# EAGLE design Honig Sensor Board_2 (EAGLE 9.6.1)
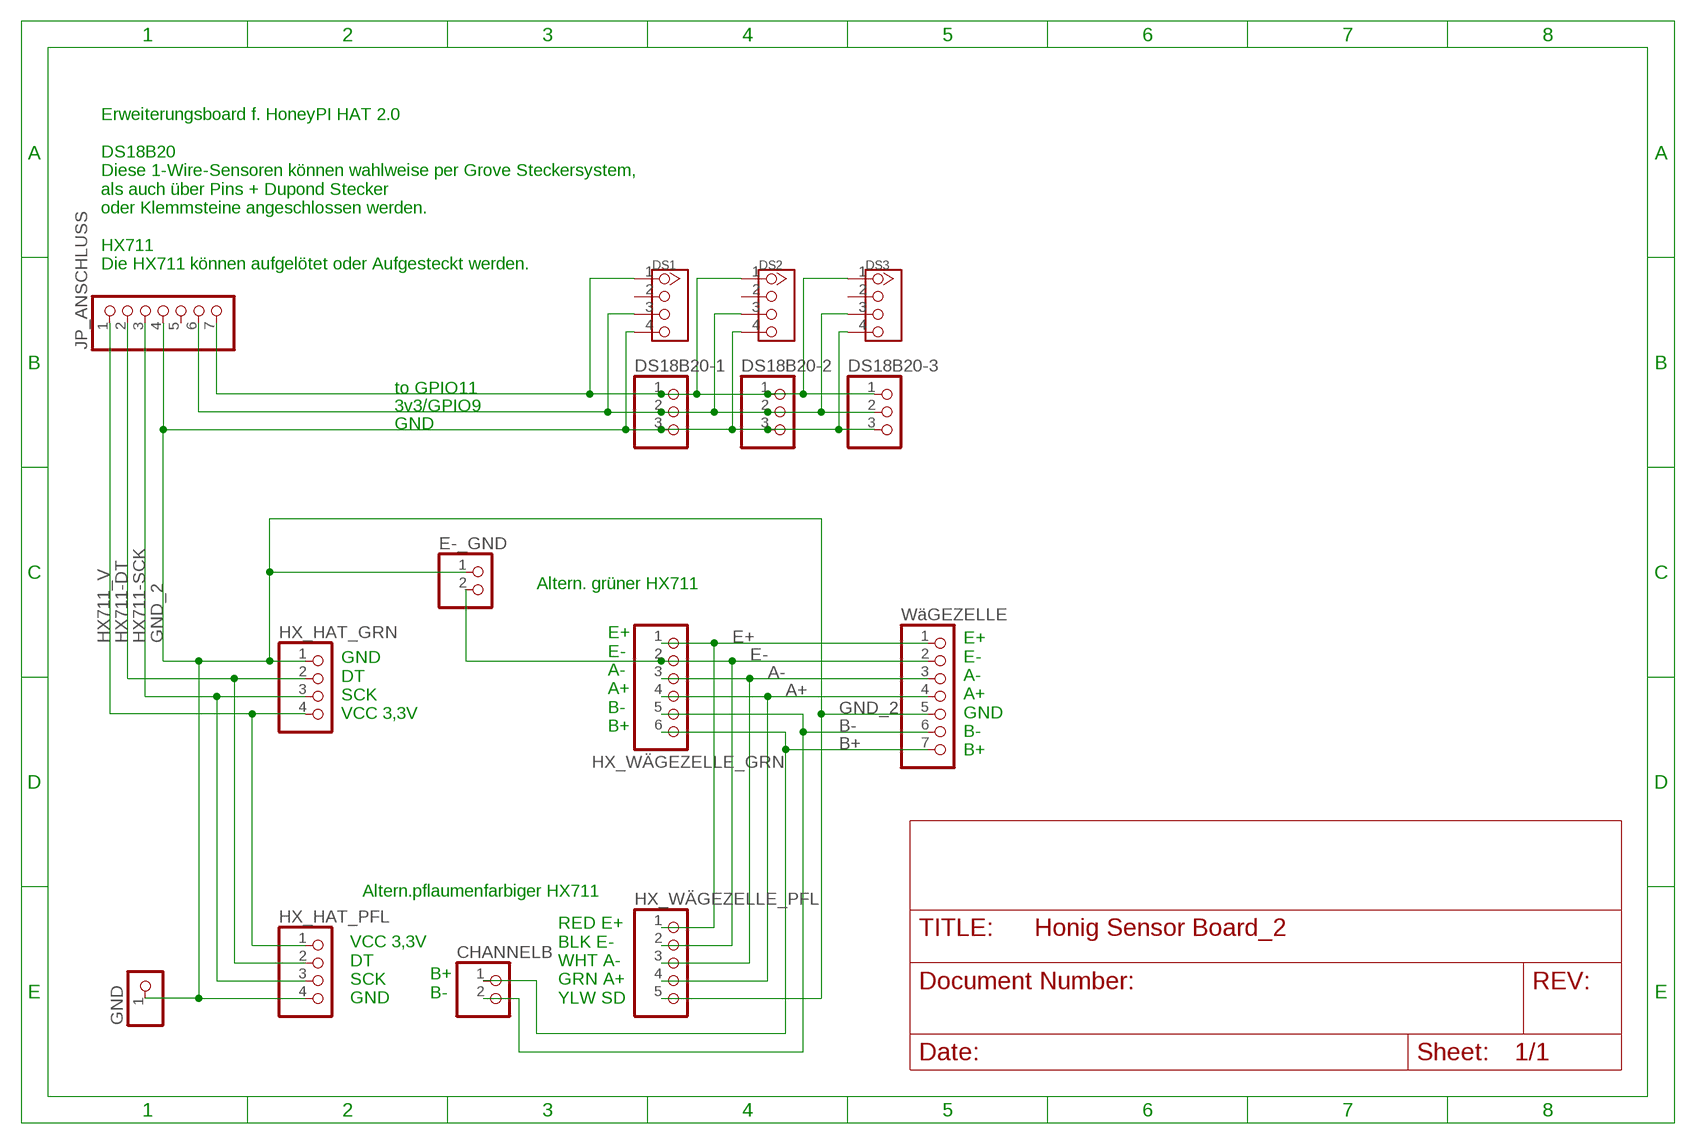
[diagram p0: schematic, sheet 1]

## Parts
CHANNELB  PINHD-1X2  [1X02]
DS1  TWIG-4P-2.0-2.0  [4P-2.0]
DS2  TWIG-4P-2.0-2.0  [4P-2.0]
DS3  TWIG-4P-2.0-2.0  [4P-2.0]
DS18B20-1  PINHD-1X3  [1X03]
DS18B20-2  PINHD-1X3  [1X03]
DS18B20-3  PINHD-1X3  [1X03]
E-_GND  PINHD-1X2  [1X02]
GND  PINHD-1X1  [1X01]
HX_HAT_GRN  PINHD-1X4  [1X04]
HX_HAT_PFL  PINHD-1X4  [1X04]
HX_WÄGEZELLE_GRN  PINHD-1X6  [1X06]
HX_WÄGEZELLE_PFL  PINHD-1X5  [1X05]
JP_ANSCHLUSS  PINHD-1X7  [1X07]
WäGEZELLE  PINHD-1X7  [1X07]

## Nets
3V3 [Supply3v3]: DS1.3 DS2.3 DS3.3 DS18B20-1.2 DS18B20-2.2 DS18B20-3.2 JP_ANSCHLUSS.6
A+: HX_WÄGEZELLE_GRN.4 HX_WÄGEZELLE_PFL.4 WäGEZELLE.4
A-: HX_WÄGEZELLE_GRN.3 HX_WÄGEZELLE_PFL.3 WäGEZELLE.3
B+: CHANNELB.1 HX_WÄGEZELLE_GRN.6 WäGEZELLE.7
B-: CHANNELB.2 HX_WÄGEZELLE_GRN.5 WäGEZELLE.6
DS18B20_DATA_GPIO11_PIN23: DS1.1 DS2.1 DS3.1 DS18B20-1.1 DS18B20-2.1 DS18B20-3.1 JP_ANSCHLUSS.7
E+: HX_WÄGEZELLE_GRN.1 HX_WÄGEZELLE_PFL.1 WäGEZELLE.1
E-: E-_GND.2 HX_WÄGEZELLE_GRN.2 HX_WÄGEZELLE_PFL.2 WäGEZELLE.2
GND_2 [Supply3v3]: DS1.4 DS2.4 DS3.4 DS18B20-1.3 DS18B20-2.3 DS18B20-3.3 E-_GND.1 GND.1 HX_HAT_GRN.1 HX_HAT_PFL.4 HX_WÄGEZELLE_PFL.5 JP_ANSCHLUSS.4 WäGEZELLE.5
HX711-DT: HX_HAT_GRN.2 HX_HAT_PFL.2 JP_ANSCHLUSS.2
HX711-SCK: HX_HAT_GRN.3 HX_HAT_PFL.3 JP_ANSCHLUSS.3
HX711_V [Supply5v]: HX_HAT_GRN.4 HX_HAT_PFL.1 JP_ANSCHLUSS.1
Unconnected: DS1.2 DS2.2 DS3.2 JP_ANSCHLUSS.5

## Notes on the sheet
- Erweiterungsboard f. HoneyPI HAT 2.0
  
  DS18B20
  Diese 1-Wire-Sensoren können wahlweise per Grove Steckersystem,
  als auch über Pins + Dupond Stecker
  oder Klemmsteine angeschlossen werden.
  
  HX711
  Die HX711 können aufgelötet oder Aufgesteckt werden.
- to GPIO11
- 3v3/GPIO9
- GND
- Altern. grüner HX711
- GND
  DT
  SCK
  VCC 3,3V
- E+
  E-
  A-
  A+
  B-
  B+
- E+
  E-
  A-
  A+
  GND
  B-
  B+
- Altern.pflaumenfarbiger HX711
- B+
  B-
- VCC 3,3V
  DT
  SCK
  GND
- RED E+
  BLK E-
  WHT A-
  GRN A+
  YLW SD

## Library data of the parts
CHANNELB E-_GND = pinhead:PINHD-1X2: PIN HEADER
DS1-DS3 = Connector:TWIG-4P-2.0
DS18B20-1-DS18B20-3 = pinhead:PINHD-1X3: PIN HEADER
GND = pinhead:PINHD-1X1: PIN HEADER
HX_HAT_GRN HX_HAT_PFL = pinhead:PINHD-1X4: PIN HEADER
HX_WÄGEZELLE_GRN = pinhead:PINHD-1X6: PIN HEADER
HX_WÄGEZELLE_PFL = pinhead:PINHD-1X5: PIN HEADER
JP_ANSCHLUSS WäGEZELLE = pinhead:PINHD-1X7: PIN HEADER

## Net classes
0 Signal: width 0.152 mm, clearance 0.305 mm
1 Supply3v3: width 0.203 mm, clearance 0.305 mm
2 Supply5v: width 0.406 mm, clearance 0.305 mm

## Board
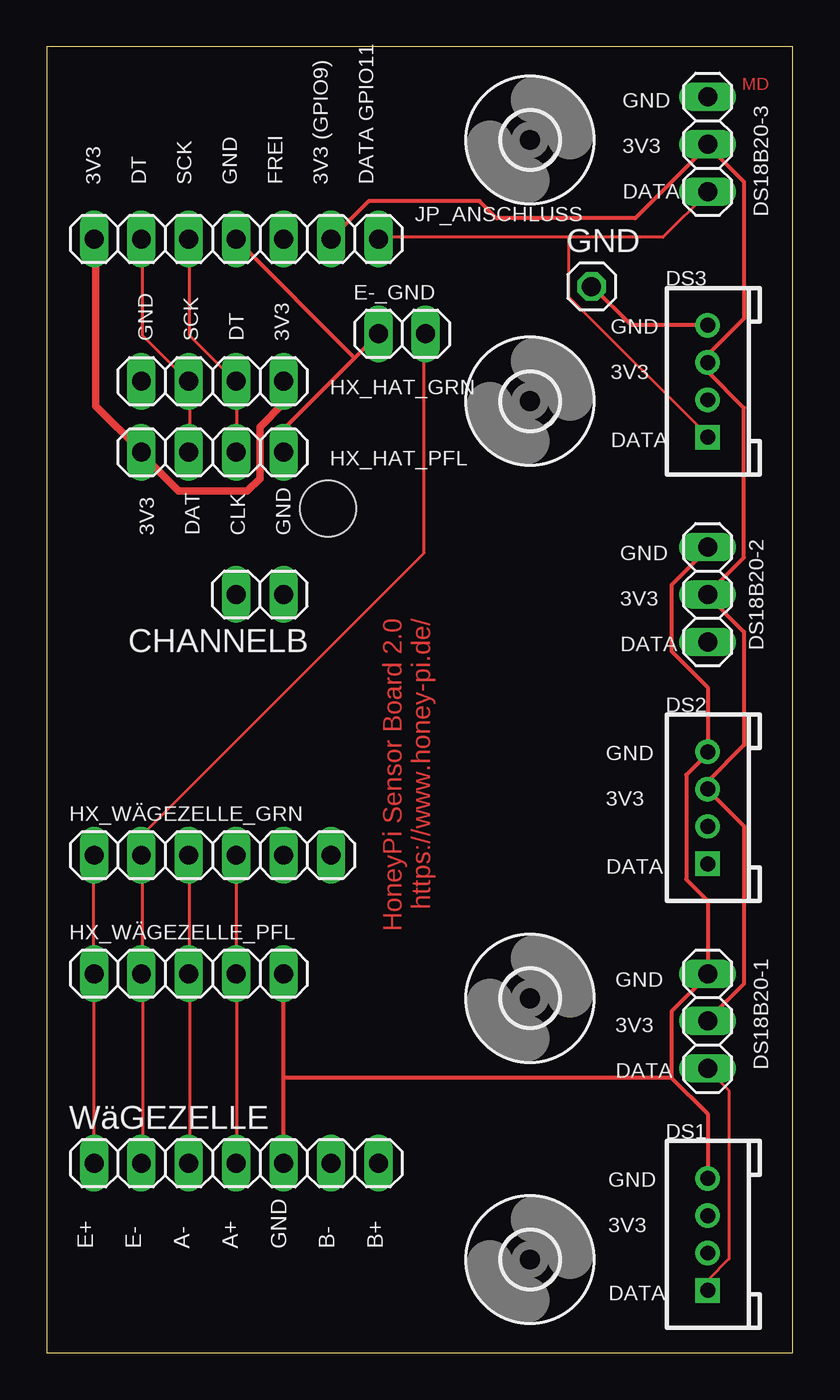
[diagram p1: board, top side]
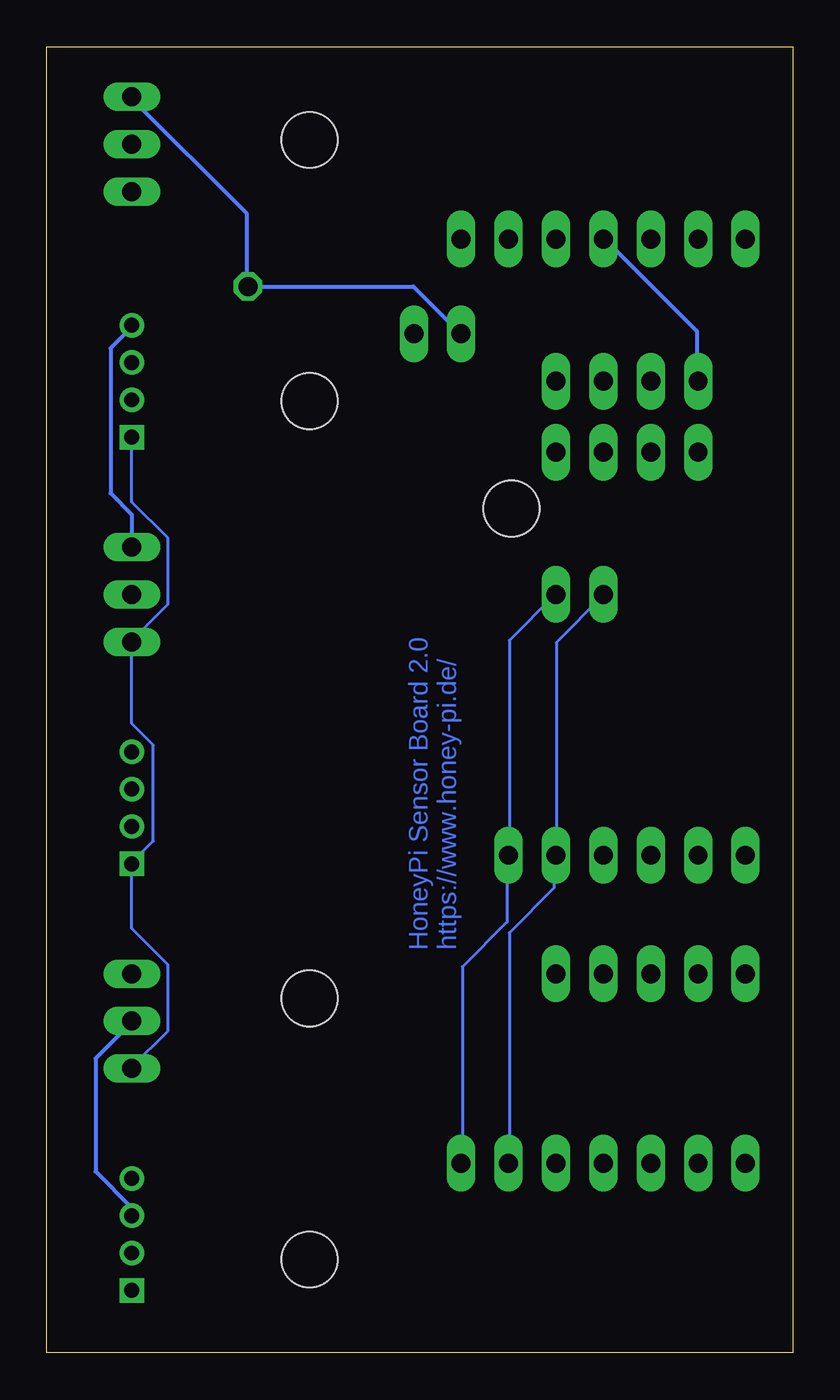
[diagram p2: board, bottom side, seen from below]

Size 40 x 70 mm. Coordinates in mm from the lower left corner, seen from the top.
Outline: 0,0 40,0 40,70 0,70 0,0
Copper layers (1*16): Top 0.035mm / dielectric 1.5mm / Bottom 0.035mm
Design rules "default *": minimum track width 6mil, minimum drill 0.35mm, track to track 6mil, track to pad 6mil, pad to pad 6mil, via to via 6mil, smd to smd 6mil, copper to edge 40mil, drill to drill 1mm, minimum pad ring 10mil, minimum via ring 8mil, stop-mask expansion 4mil, vias tented up to drill 0mil, thermal gap 10mil
Holes 3 mm at 15.08,45.24

### Footprints (pad centres in the part's own frame; a part is rotated, then mirrored left to right if it is on the bottom)
1X02 = drill 1.016 long: 1 -1.27,0; 2 1.27,0
4P-2.0 = drill 0.8 pad 1.27 square: 1 -3,0 | drill 0.8 pad 1.27: 2 -1,0; 3 1,0; 4 3,0
1X03 = drill 1.016 long: 1 -2.54,0; 2 0,0; 3 2.54,0
1X01 = drill 1.016 octagon: 1 0,0
1X04 = drill 1.016 long: 1 -3.81,0; 2 -1.27,0; 3 1.27,0; 4 3.81,0
1X06 = drill 1.016 long: 1 -6.35,0; 2 -3.81,0; 3 -1.27,0; 4 1.27,0; 5 3.81,0; 6 6.35,0
1X05 = drill 1.016 long: 1 -5.08,0; 2 -2.54,0; 3 0,0; 4 2.54,0; 5 5.08,0
1X07 = drill 1.016 long: 1 -7.62,0; 2 -5.08,0; 3 -2.54,0; 4 0,0; 5 2.54,0; 6 5.08,0; 7 7.62,0
3,0 = hole 3: 0,0

### Placement (x,y rotation side)
CHANNELB  11.43,40.64 180 top
DS1  35.43,6.35 90 top
DS2  35.43,29.21 90 top
DS3  35.43,52.07 90 top
DS18B20-1  35.43,17.78 90 top
DS18B20-2  35.43,40.64 90 top
DS18B20-3  35.43,64.77 90 top
E-_GND  19.05,54.61 0 top
GND  29.21,57.15 0 top
HX_HAT_GRN  8.89,52.07 0 top
HX_HAT_PFL  8.89,48.26 0 top
HX_WÄGEZELLE_GRN  8.89,26.67 0 top
HX_WÄGEZELLE_PFL  7.62,20.32 0 top
JP_ANSCHLUSS  10.16,59.69 0 top
U$1  [3,0]  25.91,5 0 top
U$2  [3,0]  25.91,65 0 top
U$3  [3,0]  25.91,19 0 top
U$4  [3,0]  25.91,51 0 top
WäGEZELLE  10.16,10.16 0 top

### Tracks (layer width: path | path; a pad name or v marks a point on that pad's centre or on a via)
3V3
  Top 0.203: 35.43,64.69 37.38,62.75 37.38,55.44 35.43,53.49 DS3.3 35.43,52.58 37.38,50.63 37.38,42.63 35.43,40.69 DS18B20-2.2 35.43,40.58 37.38,38.63 37.38,32.58 35.43,30.63 DS2.3 35.43,30.18 37.38,28.23 37.38,19.77 35.43,17.83 DS18B20-1.2 | 35.43,64.69 31.55,60.81 24.12,60.81 23.2,61.72 17.26,61.72 15.32,59.78 JP_ANSCHLUSS.6 | 35.43,64.69 DS18B20-3.2
  Bottom 0.203: DS1.3 35.43,7.77 37.38,9.72 37.38,15.77 35.43,17.72 DS18B20-1.2
A+
  Top 0.152: WäGEZELLE.4 10.17,10.17 10.17,20.23 HX_WÄGEZELLE_PFL.4 10.17,20.34 10.17,26.63 HX_WÄGEZELLE_GRN.4
A-
  Top 0.152: WäGEZELLE.3 7.66,10.17 7.66,20.23 HX_WÄGEZELLE_PFL.3 7.66,20.34 7.66,26.63 HX_WÄGEZELLE_GRN.3
B+
  Bottom 0.152: CHANNELB.1 12.8,40.58 15.2,38.18 15.2,26.75 HX_WÄGEZELLE_GRN.6 15.32,26.63 15.32,23.09 17.72,20.69 17.72,10.17 WäGEZELLE.7
B-
  Bottom 0.152: CHANNELB.2 10.17,40.58 12.69,38.06 12.69,26.75 HX_WÄGEZELLE_GRN.5 12.8,26.63 12.8,24.92 15.2,22.52 15.2,10.17 WäGEZELLE.6
DS18B20_DATA_GPIO11_PIN23
  Top 0.152: 28,59.78 33.03,59.78 35.43,62.18 DS18B20-3.1 | 28,59.78 17.83,59.78 JP_ANSCHLUSS.7 | DS1.1 35.43,3.89 36.58,5.03 36.58,14.06 35.43,15.2 DS18B20-1.1 | 28,59.78 28,56.58 35.43,49.15 DS3.1
  Bottom 0.152: DS3.1 35.43,45.61 33.49,43.66 33.49,40.12 35.43,38.18 DS18B20-2.1 35.43,33.72 34.29,32.58 34.29,27.43 35.43,26.29 DS2.1 35.43,22.75 33.49,20.8 33.49,17.26 35.43,15.32 DS18B20-1.1
E+
  Top 0.152: WäGEZELLE.1 2.52,10.17 2.52,20.23 HX_WÄGEZELLE_PFL.1 2.52,20.34 2.52,26.63 HX_WÄGEZELLE_GRN.1
E-
  Top 0.152: WäGEZELLE.2 5.14,10.17 5.14,20.23 HX_WÄGEZELLE_PFL.2 5.14,20.34 5.14,26.63 HX_WÄGEZELLE_GRN.2 5.14,26.75 5.14,27.77 20.23,42.86 20.23,54.52 E-_GND.2
GND_2
  Top 0.203: 12.69,14.74 12.69,20.23 HX_WÄGEZELLE_PFL.5 | 12.69,14.74 12.69,10.17 WäGEZELLE.5 | DS1.4 35.43,12.8 33.49,14.74 | 33.49,14.74 33.49,18.29 35.43,20.23 DS18B20-1.3 35.43,24.23 34.29,25.38 34.29,30.98 35.43,32.12 DS2.4 35.43,35.66 33.49,37.6 33.49,41.15 35.43,43.09 DS18B20-2.3 | 33.49,14.74 12.69,14.74 | 16.52,53.32 17.72,54.52 E-_GND.1 | 16.52,53.32 12.8,49.61 12.8,48.35 HX_HAT_PFL.4 | 16.52,53.32 10.17,59.66 JP_ANSCHLUSS.4 | DS3.4 35.43,55.09 31.32,55.09 29.26,57.15 GND.1
  Bottom 0.203: HX_HAT_GRN.1 5.14,52.12 5.14,54.75 10.06,59.66 JP_ANSCHLUSS.4 | DS18B20-3.3 35.43,67.21 29.26,61.04 29.26,57.15 GND.1 20.34,57.15 17.83,54.63 E-_GND.1 | DS18B20-2.3 35.43,44.92 36.58,46.06 36.58,53.84 35.43,54.98 DS3.4
HX711-DT
  Top 0.152: HX_HAT_PFL.2 7.66,48.35 7.66,52.01 HX_HAT_GRN.2 7.54,52.12 5.14,54.52 5.14,59.66 JP_ANSCHLUSS.2
HX711-SCK
  Top 0.152: HX_HAT_PFL.3 10.17,48.35 10.17,52.01 HX_HAT_GRN.3 10.06,52.12 7.66,54.52 7.66,59.66 JP_ANSCHLUSS.3
HX711_V
  Top 0.406: JP_ANSCHLUSS.1 2.63,59.66 2.63,50.75 5.03,48.35 HX_HAT_PFL.1 5.14,48.12 7.09,46.18 10.74,46.18 11.43,46.86 11.43,49.61 12.69,50.86 12.69,52.01 HX_HAT_GRN.4

### Text on the board
Top: MD | HoneyPi Sensor Board 2.0 / https://www.honey-pi.de/
Bottom: HoneyPi Sensor Board 2.0 / https://www.honey-pi.de/
tNames: 3V3 / / DT / / SCK / / GND / / FREI / / 3V3 (GPIO9) / / DATA GPIO11 | GND / / 3V3 / / DATA | GND / / SCK / / DT / / 3V3 | GND / / 3V3 / / / DATA | 3V3 / / DAT / / CLK / / GND | GND / / 3V3 / / DATA | GND / / 3V3 / / / DATA | GND / / 3V3 / / DATA | E+ / / E- / / A- / / A+ / / GND / / B- / / B+ | GND / / 3V3 / / / DATA